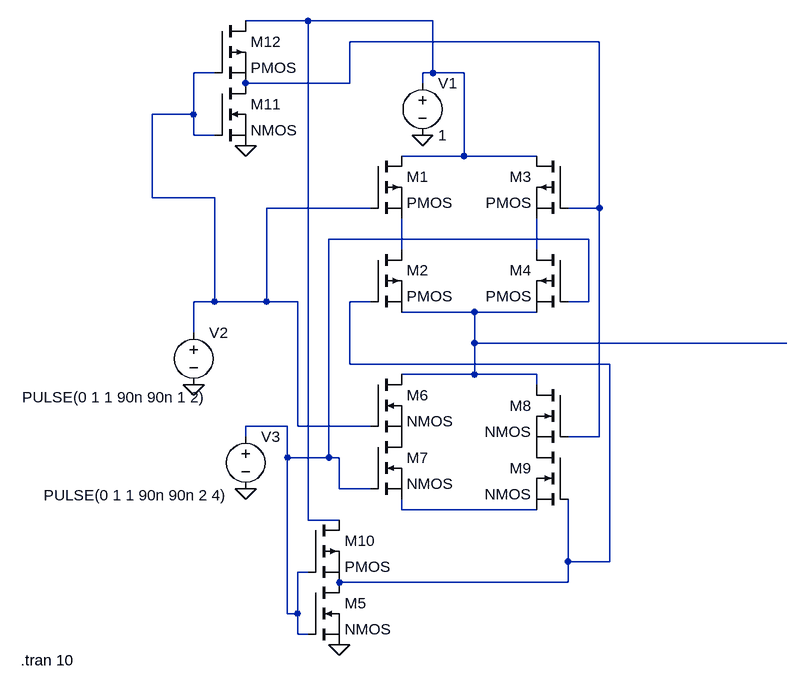
[diagram p0: schematic Draft7.asc]
Draft7.asc, the LTspice schematic file:
Version 4
SHEET 1 880 712
WIRE -240 -288 -336 -288
WIRE -48 -288 -240 -288
WIRE 208 -256 -176 -256
WIRE -384 -208 -416 -208
WIRE -48 -208 -48 -288
WIRE -48 -208 -64 -208
WIRE 0 -208 -48 -208
WIRE -176 -192 -176 -256
WIRE -176 -192 -336 -192
WIRE -64 -192 -64 -208
WIRE -416 -144 -416 -208
WIRE -416 -144 -480 -144
WIRE -416 -112 -416 -144
WIRE -384 -112 -416 -112
WIRE 0 -80 0 -208
WIRE 0 -80 -96 -80
WIRE 112 -80 0 -80
WIRE -480 -16 -480 -144
WIRE -384 -16 -480 -16
WIRE -144 0 -304 0
WIRE 208 0 208 -256
WIRE 208 0 160 0
WIRE 192 48 -208 48
WIRE -96 64 -96 16
WIRE 112 64 112 16
WIRE -384 144 -384 -16
WIRE -384 144 -416 144
WIRE -304 144 -304 0
WIRE -304 144 -384 144
WIRE -256 144 -304 144
WIRE -144 144 -176 144
WIRE 192 144 192 48
WIRE 192 144 160 144
WIRE 16 160 -96 160
WIRE 112 160 16 160
WIRE -416 192 -416 144
WIRE 16 208 16 160
WIRE 496 208 16 208
WIRE -176 240 -176 144
WIRE 224 240 -176 240
WIRE 16 256 16 208
WIRE 16 256 -96 256
WIRE 112 256 16 256
WIRE 112 272 112 256
WIRE -272 336 -336 336
WIRE -256 336 -256 144
WIRE -144 336 -256 336
WIRE -336 352 -336 336
WIRE 208 352 208 0
WIRE 208 352 160 352
WIRE -272 384 -272 336
WIRE -208 384 -208 48
WIRE -208 384 -272 384
WIRE -192 384 -208 384
WIRE -192 432 -192 384
WIRE -144 432 -192 432
WIRE -96 464 -96 448
WIRE 112 464 -96 464
WIRE -240 480 -240 -288
WIRE -192 480 -240 480
WIRE 160 544 160 448
WIRE 224 544 224 240
WIRE 224 544 160 544
WIRE -240 560 -256 560
WIRE 160 576 160 544
WIRE 160 576 -192 576
WIRE -272 624 -272 384
WIRE -256 624 -256 560
WIRE -256 624 -272 624
WIRE -256 656 -256 624
WIRE -240 656 -256 656
FLAG -64 -112 0
FLAG -416 272 0
FLAG -336 432 0
FLAG -192 672 0
FLAG -336 -96 0
SYMBOL pmos -144 -80 R0
SYMATTR InstName M1
SYMBOL pmos -144 64 R0
SYMATTR InstName M2
SYMBOL pmos 160 -80 M0
SYMATTR InstName M3
SYMBOL pmos 160 64 M0
SYMATTR InstName M4
SYMBOL nmos -144 256 R0
SYMATTR InstName M6
SYMBOL nmos -144 352 R0
SYMATTR InstName M7
SYMBOL nmos 160 272 M0
SYMATTR InstName M8
SYMBOL nmos 160 368 M0
SYMATTR InstName M9
SYMBOL voltage -64 -208 R0
WINDOW 123 0 0 Left 0
WINDOW 39 0 0 Left 0
SYMATTR InstName V1
SYMATTR Value 1
SYMBOL voltage -416 176 R0
WINDOW 3 -264 115 Left 2
WINDOW 123 0 0 Left 0
WINDOW 39 0 0 Left 0
SYMATTR InstName V2
SYMATTR Value PULSE(0 1 1 90n 90n 1 2)
SYMBOL voltage -336 336 R0
WINDOW 3 -311 106 Left 2
WINDOW 123 0 0 Left 0
WINDOW 39 0 0 Left 0
SYMATTR InstName V3
SYMATTR Value PULSE(0 1 1 90n 90n 2 4)
SYMBOL nmos -240 576 R0
SYMATTR InstName M5
SYMBOL pmos -240 480 R0
SYMATTR InstName M10
SYMBOL nmos -384 -192 R0
SYMATTR InstName M11
SYMBOL pmos -384 -288 R0
SYMATTR InstName M12
TEXT -682 696 Left 2 !.tran 10

The netlist it stands for:
* Draft7.asc
M1 N001 N003 N005 N005 PMOS
M2 N005 N007 N008 N008 PMOS
M3 N001 N002 N006 N006 PMOS
M4 N006 N004 N008 N008 PMOS
M6 N008 N003 P001 P001 NMOS
M7 P001 N004 N009 N009 NMOS
M8 N008 N002 P002 P002 NMOS
M9 P002 N007 N009 N009 NMOS
V1 N001 0 1
V2 N003 0 PULSE(0 1 1 90n 90n 1 2)
V3 N004 0 PULSE(0 1 1 90n 90n 2 4)
M5 N007 N004 0 0 NMOS
M10 N001 N004 N007 N007 PMOS
M11 N002 N003 0 0 NMOS
M12 N001 N003 N002 N002 PMOS
.model NMOS NMOS
.model PMOS PMOS
.lib standard.mos
.tran 10
.backanno
.end